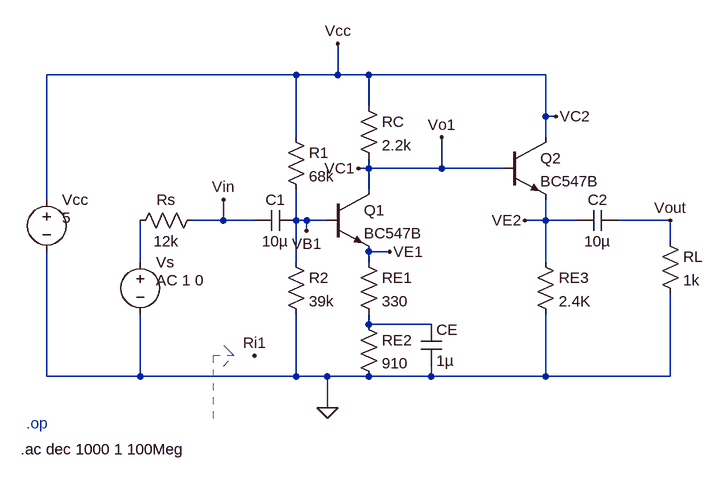
[diagram p0: schematic Circuito_Amplificador.asc]
Circuito_Amplificador.asc, the LTspice schematic file:
Version 4
SHEET 1 880 680
WIRE -48 -112 -432 -112
WIRE 16 -112 16 -160
WIRE 16 -112 -48 -112
WIRE 64 -112 16 -112
WIRE 336 -112 64 -112
WIRE 64 -64 64 -112
WIRE 336 -48 336 -112
WIRE 352 -48 336 -48
WIRE -48 -16 -48 -112
WIRE 336 -16 336 -48
WIRE 64 32 64 16
WIRE 64 32 48 32
WIRE 176 32 176 -16
WIRE 176 32 64 32
WIRE 272 32 176 32
WIRE 64 64 64 32
WIRE -432 80 -432 -112
WIRE -160 112 -160 80
WIRE -160 112 -208 112
WIRE -112 112 -160 112
WIRE -48 112 -48 64
WIRE -32 112 -48 112
WIRE 0 112 -32 112
WIRE 336 112 336 80
WIRE 336 112 304 112
WIRE 384 112 336 112
WIRE 528 112 448 112
WIRE -32 128 -32 112
WIRE 528 144 528 112
WIRE 96 160 64 160
WIRE -288 176 -288 112
WIRE -48 176 -48 112
WIRE 64 176 64 160
WIRE 336 176 336 112
WIRE 64 272 64 256
WIRE 160 272 64 272
WIRE -432 352 -432 160
WIRE -288 352 -288 256
WIRE -288 352 -432 352
WIRE -48 352 -48 256
WIRE -48 352 -288 352
WIRE 0 352 -48 352
WIRE 64 352 0 352
WIRE 160 352 160 336
WIRE 160 352 64 352
WIRE 336 352 336 256
WIRE 336 352 160 352
WIRE 528 352 528 224
WIRE 528 352 336 352
WIRE 0 400 0 352
FLAG 16 -160 Vcc
FLAG 0 400 0
FLAG 176 -16 Vo1
FLAG -160 80 Vin
FLAG 528 112 Vout
FLAG -112 320 Ri1
FLAG 96 160 VE1
FLAG -32 128 VB1
FLAG 48 32 VC1
FLAG 352 -48 VC2
FLAG 304 112 VE2
SYMBOL npn 0 64 R0
SYMATTR InstName Q1
SYMATTR Value BC547B
SYMBOL res -64 -32 R0
SYMATTR InstName R1
SYMATTR Value 68k
SYMBOL res -64 160 R0
SYMATTR InstName R2
SYMATTR Value 39k
SYMBOL res 48 -80 R0
SYMATTR InstName RC
SYMATTR Value 2.2k
SYMBOL voltage -432 64 R0
WINDOW 123 24 124 Left 2
WINDOW 39 0 0 Left 0
WINDOW 3 24 44 Left 2
SYMATTR Value 5
SYMATTR InstName Vcc
SYMBOL res -192 96 R90
WINDOW 0 0 56 VBottom 2
WINDOW 3 32 56 VTop 2
SYMATTR InstName Rs
SYMATTR Value 12k
SYMBOL voltage -288 160 R0
WINDOW 123 24 44 Left 2
WINDOW 39 0 0 Left 0
SYMATTR Value2 AC 1 0
SYMATTR InstName Vs
SYMATTR Value ""
SYMBOL npn 272 -16 R0
SYMATTR InstName Q2
SYMATTR Value BC547B
SYMBOL res 48 160 R0
SYMATTR InstName RE1
SYMATTR Value 330
SYMBOL res 48 256 R0
SYMATTR InstName RE2
SYMATTR Value 910
SYMBOL cap 144 272 R0
SYMATTR InstName CE
SYMATTR Value 1µ
SYMBOL res 320 160 R0
SYMATTR InstName RE3
SYMATTR Value 2.4K
SYMBOL cap 448 96 R90
WINDOW 0 0 32 VBottom 2
WINDOW 3 32 32 VTop 2
SYMATTR InstName C2
SYMATTR Value 10µ
SYMBOL res 512 128 R0
SYMATTR InstName RL
SYMATTR Value 1k
SYMBOL cap -112 128 R270
WINDOW 0 32 32 VTop 2
WINDOW 3 0 32 VBottom 2
SYMATTR InstName C1
SYMATTR Value 10µ
TEXT -464 424 Left 2 ;.op
TEXT -472 464 Left 2 !.ac dec 1000 1 100Meg
LINE Normal -176 320 -176 416 2
LINE Normal -144 320 -176 320 2
LINE Normal -160 304 -144 320 2
LINE Normal -144 320 -160 304 2
LINE Normal -160 336 -144 320 2

The netlist it stands for:
* Circuito_Amplificador.asc
Q1 VC1 VB1 VE1 0 BC547B
R1 VC2 VB1 68k
R2 VB1 0 39k
RC VC2 VC1 2.2k
Vcc VC2 0 5
Rs Vin N001 12k
Vs N001 0 AC 1 0
Q2 VC2 VC1 VE2 0 BC547B
RE1 VE1 N002 330
RE2 N002 0 910
CE N002 0 1µ
RE3 VE2 0 2.4K
C2 Vout VE2 10µ
RL Vout 0 1k
C1 Vin VB1 10µ
.model NPN NPN
.model PNP PNP
.lib standard.bjt
* .op
.ac dec 1000 1 100Meg
.backanno
.end